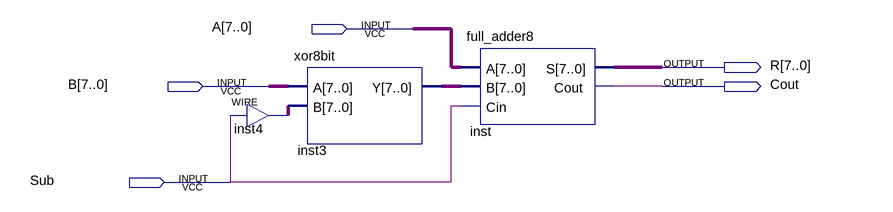
[diagram p0: schematic sheet]
// Quartus schematic addsub8.bdf as structural Verilog: 3 symbols, 5 pins
module addsub8 (
  input  [7:0] A,
  input  [7:0] B,
  input  Sub,
  output [7:0] R,
  output Cout
);

  wire [7:0] inst3_y, inst4_out;

  assign inst4_out = {8{Sub}};  // WIRE inst4
  xor8bit inst3 (.A(B), .B(inst4_out), .Y(inst3_y));
  full_adder8 inst (.A(A), .B(inst3_y), .Cin(Sub), .S(R), .Cout(Cout));
endmodule
